# Altium schematic sheet Sheet2.SchDoc
size 381 x 241 mm; SheetNumber: 1; SheetTotal: 1
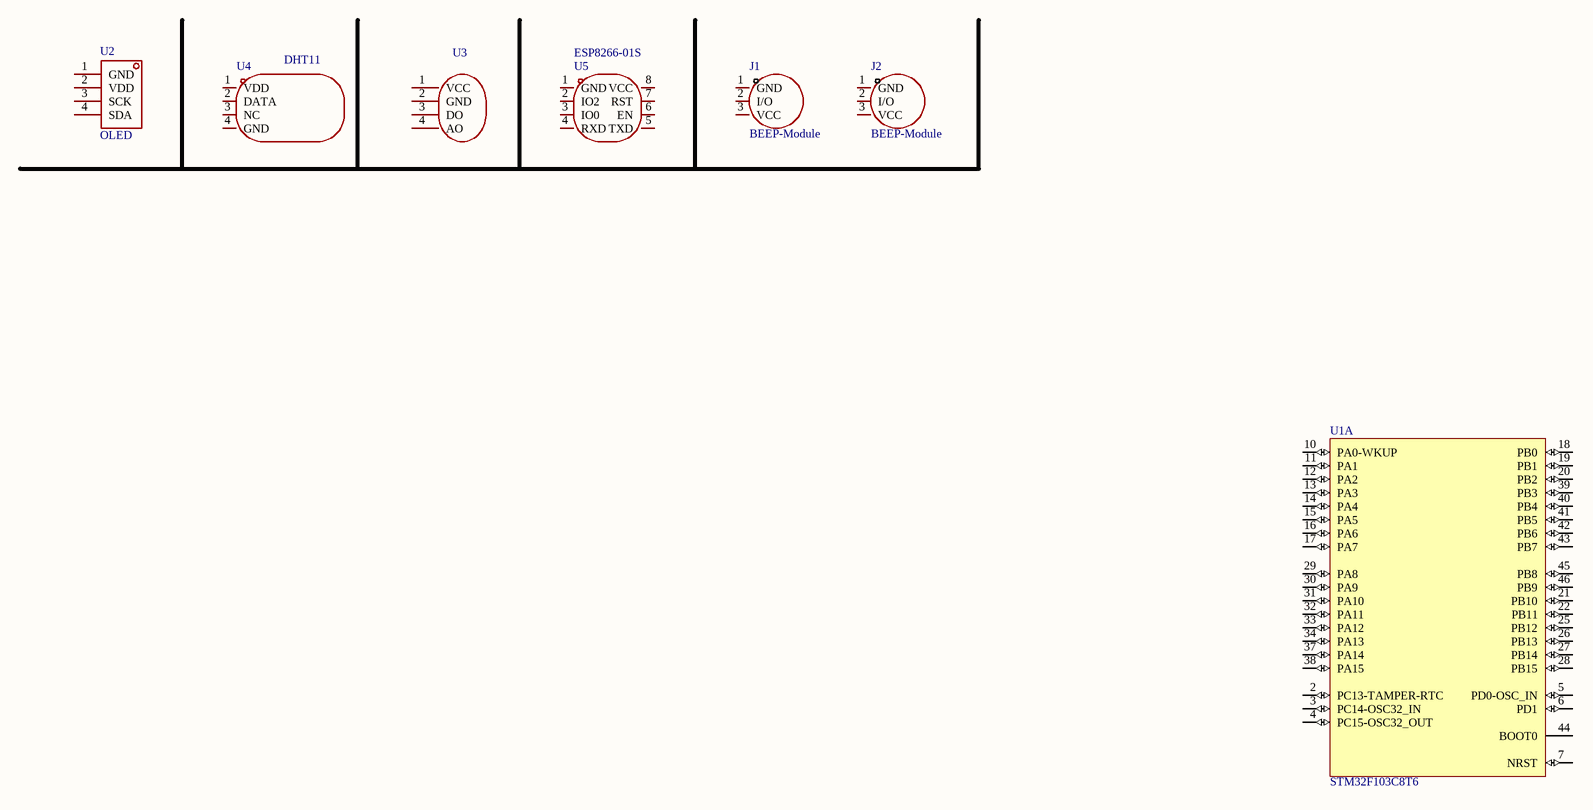
[diagram p0: Sheet2.SchDoc]

## Parts
J1  BEEP-Module  [HDR-F-2.54_1X3]
J2  BEEP-Module  [HDR-F-2.54_1X3]
U1  STM32F103C8T6  [TQFP48 7x7_L]  (part A of 2)
U2  OLED  [0.96OLED_4P]
U3  (no value)  [mq2]
U4  DHT11  [SENSOR-TH_DHT11]
U5  ESP8266-01S  [WIFIM-TH_ESP8266-01S]

## Nets

Not connected (* = marked no-connect by the designer): J1 1(GND) 2(I/O) 3(VCC); J2 1(GND) 2(I/O) 3(VCC); U1 2(PC13-TAMPER-RTC) 3(PC14-OSC32_IN) 4(PC15-OSC32_OUT) 5(PD0-OSC_IN) 6(PD1) 7(NRST) 10(PA0-WKUP) 11(PA1) 12(PA2) 13(PA3) 14(PA4) 15(PA5) 16(PA6) 17(PA7) 18(PB0) 19(PB1) 20(PB2) 21(PB10) 22(PB11) 25(PB12) 26(PB13) 27(PB14) 28(PB15) 29(PA8) 30(PA9) 31(PA10) 32(PA11) 33(PA12) 34(PA13) 37(PA14) 38(PA15) 39(PB3) 40(PB4) 41(PB5) 42(PB6) 43(PB7) 44(BOOT0) 45(PB8) 46(PB9); U2 1(GND) 2(VDD) 3(SCK) 4(SDA); U3 1(VCC) 2(GND) 3(DO) 4(AO); U4 1(VDD) 2(DATA) 3(NC) 4(GND); U5 1(GND) 2(IO2) 3(IO0) 4(RXD) 5(TXD) 6(EN) 7(RST) 8(VCC)

## Library data of the parts
J1 J2 = BEEP-Module: Convert to PCB: yes; Symbol: BEEP-Module; Device: BEEP-Module; Add into BOM: yes
U1 = STM32F103C8T6: STM32 ARM-based 32-bit MCU Performance Line with 64 kB Flash, 20 kB Internal RAM, -40 to +85癈 Temperature, 48-Pin LQFP, Tray; DatasheetVersion: rev13.0, Apr-2011; PackageVersion: rev13, Apr-2011; PackageReference: LQFP48; PackageDescription: 48-Pin Low-Profile Quad Flat Pack, 7 x 7 mm Body, 0.5 mm Pitch (LQFP48); ComponentLink1Description: Manufacturer URL; ComponentLink1URL: http://www.st.com/; ComponentLink2Description: STM32F103 Datasheet; ComponentLink2URL: http://www.st.com/internet/com/TECHNICAL_RESOURCES/TECHNICAL_LITERATURE/DATASHEET/CD00161566.pdf; ComponentLink3Description: STM32 Family Web Page; ComponentLink3URL: www.st.com/stm32; 联系售后: https://shop463601444.taobao.com
U2 = 0.96OLED: Add into BOM: yes; Symbol: 0.96OLED; Device: 0.96OLED; Convert to PCB: yes
U3 = MQ2: Convert to PCB: yes; Symbol: MQ2; Device: MQ2; Add into BOM: yes
U4 = DHT11: Manufacturer: 广州奥松; Add into BOM: yes; Symbol: DHT11; Device: DHT11; Supplier: LCSC; Supplier Part: C117051; Manufacturer Part: DHT11; JLCPCB Part Class: Extended Part; LCSC Part Name: DHT11  电容式传感器; Supplier Footprint: SIP-4; Datasheet: https://atta.szlcsc.com/upload/public/pdf/source/20170703/1499081238365.pdf; Convert to PCB: yes
U5 = ESP8266-01S: Add into BOM: yes; Symbol: ESP8266-01S; Device: ESP8266-01S; LCSC Part Name: ESP8266-01S; Supplier Part: C9900150497; Manufacturer Part: ESP8266-01S; Supplier Footprint: TH-8P; JLCPCB Part Class: 扩展库; Supplier: LCSC; Convert to PCB: yes